# Altium schematic sheet Power.SchDoc: Power
size A4; SheetNumber: 5; SheetTotal: 7
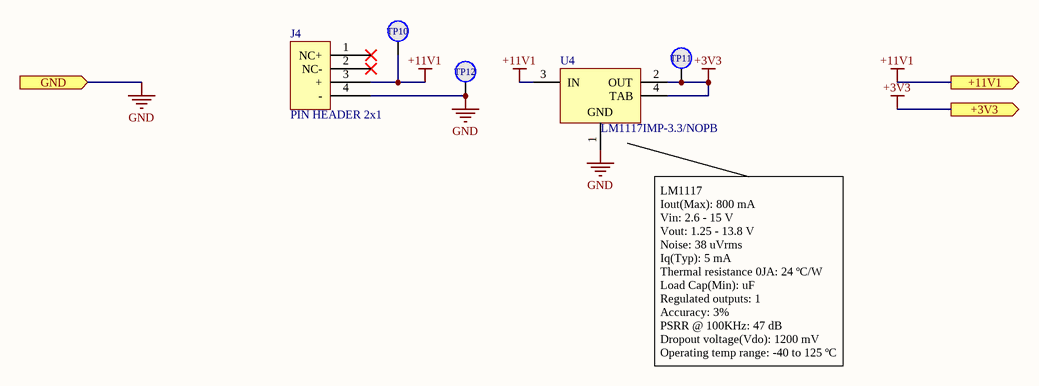
[diagram p0: Power.SchDoc]

## Parts
J4  PIN HEADER 2x1  [M20-9950245]
TP10  Test point  [TestPoint]  (value not drawn)  (no BOM)
TP11  Test point  [TestPoint]  (value not drawn)  (no BOM)
TP12  Test point  [TestPoint]  (value not drawn)  (no BOM)
U4  LM1117IMP-3.3/NOPB  [DCY0004A_N]

## Ports
+3V3 (out), +11V1 (out), GND (in)

## Nets
+3V3: TP11.1 U4.2(OUT) U4.4(TAB) ; port +3V3
+11V1: J4.3(+) TP10.1 U4.3(IN) ; port +11V1
GND: J4.4(-) TP12.1 U4.1(GND) ; port GND

Not connected (* = marked no-connect by the designer): J4 1(NC+)* 2(NC-)*

## Notes on the sheet
- LM1117
  Iout(Max): 800 mA
  Vin: 2.6 - 15 V
  Vout: 1.25 - 13.8 V
  Noise: 38 uVrms
  Iq(Typ): 5 mA
  Thermal resistance 0JA: 24 ºC/W
  Load Cap(Min): uF
  Regulated outputs: 1
  Accuracy: 3%
  PSRR @ 100KHz: 47 dB
  Dropout voltage(Vdo): 1200 mV
  Operating temp range: -40 to 125 ºC
- Designer's signature
- Sheet title:
- Supervisor's signature
- Project title:
- Desginer:
- Date:
- Revision:
- Sheet
- of
- Tecnologías de Circuitos Impresos
  Grado en Ingeniería de Tecnologías de Telecomunicación
  ETSIIT. University of Granada
  C/ Periodista Daniel Saucedo Aranda, s/n, 18014, Granada, Granada, Spain

## Library data of the parts
J4 = M20-9950245: M20-9950245 Pin Connector; ComponentLink1Description: Datasheet; ComponentLink1URL: https://www.snapeda.com/parts/M20-9950245/Harwin/datasheet/; System: Connector
TP10-TP12 = TestPoint
U4 = CMP-0062-01631-4: 800mA Low-Dropout Linear Regulator, 4-pin SOT-223, Pb-Free; Manufacturer: Texas Instruments; PackageTopMarking: XYTT*N05B; PowerWise: N; High-Reliability: Y; CompType: LDO IC; Code_IPC: SOT223-4; PackageReference: DCY0004A; PinCount: 4; PackageDescription: Molded SOT-223, 6.50 x 3.56 x 1.6mm Body, 4 Lead, 2.3mm Pitch; PartNumber: LM1117IMP-3.3/NOPB; RoHS: Y; ComponentLink1Description: Datasheet URL; Code_JEDEC: TO-261-AA; ComponentLink1URL: http://www.ti.com/general/docs/lit/getliterature.tsp?genericPartNumber=LM1117-N&fileType=pdf; Manufacturer Part Number: LM1117IMP-3.3/NOPB; Category: Voltage Regulator